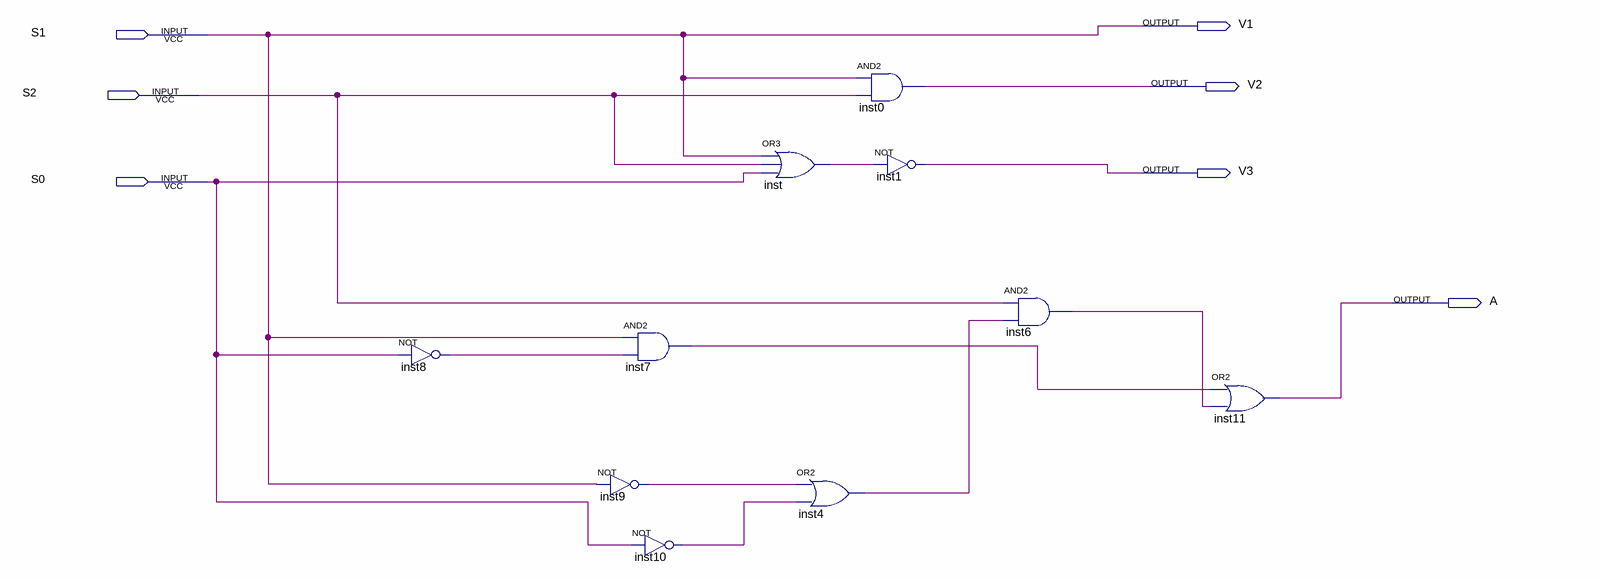
[diagram p0: schematic sheet]
// Quartus schematic aula02.bdf as structural Verilog: 10 symbols, 7 pins
module aula02 (
  input  S1,
  input  S2,
  input  S0,
  output V1,
  output V2,
  output V3,
  output A
);

  wire inst4_out, inst6_out, inst7_out, inst8_out, inst9_out, inst10_out, inst_out;

  not inst8 (inst8_out, S0);
  and inst7 (inst7_out, S1, inst8_out);
  not inst9 (inst9_out, S1);
  not inst10 (inst10_out, S0);
  or inst (inst_out, S1, S2, S0);
  or inst4 (inst4_out, inst9_out, inst10_out);
  and inst0 (V2, S1, S2);
  not inst1 (V3, inst_out);
  and inst6 (inst6_out, S2, inst4_out);
  or inst11 (A, inst7_out, inst6_out);

  assign V1 = S1;
endmodule
